# Altium schematic sheet Audio_Filters.SchDoc
size A
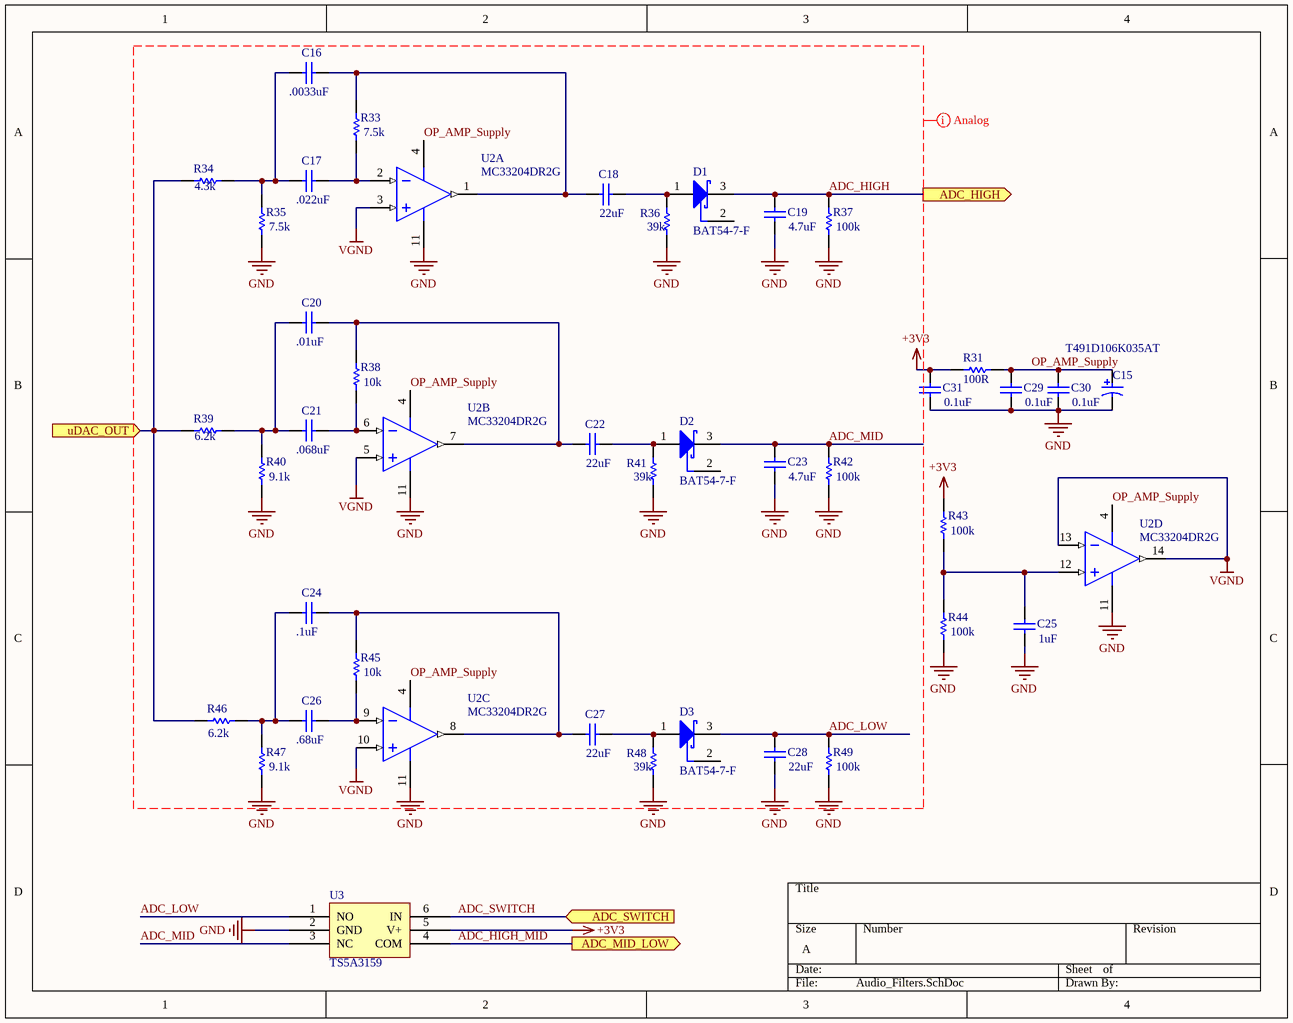
[diagram p0: Audio_Filters.SchDoc]

## Parts
C15  T491D106K035AT  [KEMT-T491-D_L]
C16  value .0033uF  [CAPC0805(2012)145_L]  (hidden comment: CAP0805)
C17  value .022uF  [CAPC0805(2012)145_L]  (hidden comment: CAP0805)
C18  value 22uF  [CAPC0805(2012)145_L]  (hidden comment: CAP0805)
C19  value 4.7uF  [CAPC0805(2012)145_L]  (hidden comment: CAP0805)
C20  value .01uF  [CAPC0805(2012)145_L]  (hidden comment: CAP0805)
C21  value .068uF  [CAPC0805(2012)145_L]  (hidden comment: CAP0805)
C22  value 22uF  [CAPC0805(2012)145_L]  (hidden comment: CAP0805)
C23  value 4.7uF  [CAPC0805(2012)145_L]  (hidden comment: CAP0805)
C24  value .1uF  [CAPC0805(2012)145_L]  (hidden comment: CAP0805)
C25  value 1uF  [CAPC0805(2012)145_L]  (hidden comment: CAP0805)
C26  value .68uF  [CAPC0805(2012)145_L]  (hidden comment: CAP0805)
C27  value 22uF  [CAPC0805(2012)145_L]  (hidden comment: CAP0805)
C28  value 22uF  [CAPC0805(2012)145_L]  (hidden comment: CAP0805)
C29  value 0.1uF  [CAPC0805(2012)145_L]  (hidden comment: CAP0805)
C30  value 0.1uF  [CAPC0805(2012)145_L]  (hidden comment: CAP0805)
C31  value 0.1uF  [CAPC0805(2012)145_L]  (hidden comment: CAP0805)
D1  BAT54-7-F  [DIOD-SOT23-3_V]
D2  BAT54-7-F  [DIOD-SOT23-3_V]
D3  BAT54-7-F  [DIOD-SOT23-3_V]
R31  value 100R  [RESC0805(2012)_L]  (hidden comment: RES0805)
R33  value 7.5k  [RESC0805(2012)_L]  (hidden comment: RES0805)
R34  value 4.3k  [RESC0805(2012)_L]  (hidden comment: RES0805)
R35  value 7.5k  [RESC0805(2012)_L]  (hidden comment: RES0805)
R36  value 39k  [RESC0805(2012)_L]  (hidden comment: RES0805)
R37  value 100k  [RESC0805(2012)_L]  (hidden comment: RES0805)
R38  value 10k  [RESC0805(2012)_L]  (hidden comment: RES0805)
R39  value 6.2k  [RESC0805(2012)_L]  (hidden comment: RES0805)
R40  value 9.1k  [RESC0805(2012)_L]  (hidden comment: RES0805)
R41  value 39k  [RESC0805(2012)_L]  (hidden comment: RES0805)
R42  value 100k  [RESC0805(2012)_L]  (hidden comment: RES0805)
R43  value 100k  [RESC0805(2012)_L]  (hidden comment: RES0805)
R44  value 100k  [RESC0805(2012)_L]  (hidden comment: RES0805)
R45  value 10k  [RESC0805(2012)_L]  (hidden comment: RES0805)
R46  value 6.2k  [RESC0805(2012)_L]  (hidden comment: RES0805)
R47  value 9.1k  [RESC0805(2012)_L]  (hidden comment: RES0805)
R48  value 39k  [RESC0805(2012)_L]  (hidden comment: RES0805)
R49  value 100k  [RESC0805(2012)_L]  (hidden comment: RES0805)
U2  MC33204DR2G  [ONSC-SOIC-14-751A-03_V]  (parts A,B,C,D of 4)
U3  TS5A3159  [SOT95P280X145-6N]

## Ports
ADC_HIGH (out), ADC_MID_LOW (out), ADC_SWITCH (in), uDAC_OUT (in)

## Nets
+3V3: C31.2 R31.2 R43.2 U3.5(V+)
GND: C15.2 C19.1 C23.1 C25.1 C28.1 C29.1 C30.1 C31.1 R35.2 R36.1 R37.1 R40.2 R41.1 R42.1 R44.1 R47.2 R48.1 R49.1 U2.11(VEE) U3.2(GND)
VGND: U2.3(IN1+) U2.5(IN2+) U2.10(IN3+) U2.13(IN4-) U2.14(OUT4)
ADC_HIGH: C19.2 D1.3(K) R37.2 ; port ADC_HIGH
ADC_HIGH_MID: U3.4(COM) ; port ADC_MID_LOW
ADC_LOW: C28.2 D3.3(K) R49.2 U3.1(NO)
ADC_MID: C23.2 D2.3(K) R42.2 U3.3(NC)
ADC_SWITCH: U3.6(IN) ; port ADC_SWITCH
OP_AMP_Supply: C15.1 C29.2 C30.2 R31.1 U2.4(VCC)
uDAC_OUT: R34.1 R39.1 R46.1 ; port uDAC_OUT
NetC16_1: C16.1 C17.1 R34.2 R35.1
NetC16_2: C16.2 C18.1 R33.1 U2.1(OUT1)
NetC17_2: C17.2 R33.2 U2.2(IN1-)
NetC18_2: C18.2 D1.1(A) R36.2
NetC20_1: C20.1 C21.1 R39.2 R40.1
NetC20_2: C20.2 C22.1 R38.1 U2.7(OUT2)
NetC21_2: C21.2 R38.2 U2.6(IN2-)
NetC22_2: C22.2 D2.1(A) R41.2
NetC24_1: C24.1 C26.1 R46.2 R47.1
NetC24_2: C24.2 C27.1 R45.1 U2.8(OUT3)
NetC25_2: C25.2 R43.1 R44.2 U2.12(IN4+)
NetC26_2: C26.2 R45.2 U2.9(IN3-)
NetC27_2: C27.2 D3.1(A) R48.2

Not connected (* = marked no-connect by the designer): D1 2; D2 2; D3 2

## Layout directives
net class Analog: +3V3, ADC_HIGH, ADC_LOW, ADC_MID, GND, OP_AMP_Supply, VGND

## Library data of the parts
C15 = CMP-2000-07580-1: Tantalum Capacitor, 10 uF, +/- 10%, 35 V, -55 to 125 degC, 2-Pin SMD, RoHS, Tape and Reel; Manufacturer: Kemet; Capacitance: 10uF; Leakage Current: 3.5uA; Dissipation Factor: 6%; Case\/Package: 2917; Polarity: Polar; Voltage Rating: 35V; ESR (Equivalent Series Resistance): 1Ohm; Life (Hours): 2000Hour; Tolerance: 20%; Max Operating Temperature: 125degC; Length: 7.3mm; Depth: 4.3mm; Termination: SMD/SMT; Case Code (Metric): 7343; Number of Pins: 2; Package Reference: T491-D; Width: 4.3mm; RoHSCompliant: True; Lead Free: LeadFree; Radiation Hardening: No; Height: 2.8mm; Voltage Rating (DC): 35V; REACH SVHC: NoSVHC; Datasheet URL: http://www.kemet.com/Lists/ProductCatalog/Attachments/254/KEM_T2005_T491.pdf; Datasheet Version: 07/2017; Manufacturer URL: http://www.kemet.com/; Mounting Technology: SurfaceMount; Min Operating Temperature: -55degC; Case Code (Imperial): 2917; Package Quantity: 1; Packaging: TapeandReel; Package Description: 2-Pin Surface Mount Device, Body 7.3 x 4.3 mm; Height - Seated (Max): 0.122inch; Voltage: 35V; Dielectric Material: Tantalum; Mount: PCB
C16-C31 = CMP-1590-00003-1: 0805 (2012 Metric) Chip Capacitor; Case-EIA: 0805; Case-Metric: 2012; PackageReference: CAPC0805(2012)145
D1-D3 = CMP-0303-00002-1: Schottky Diode, 30V ,200mW, SOT23-3; Manufacturer: Diodes Inc; Forward Current Limit: 200 mA; Reverse Current: 2 uA @25 V; PackageReference: SOT23; ComponentLink3URL: http://www.diodes.com/datasheets/ap02002.pdf; ComponentLink3Description: Package Specification; PartNumber: BAT54-7-F; Storage Temperature: -55 to 150 degC; ComponentLink1Description: Manufacturer URL; Mounting Technology: Surface Mount; ComponentLink2Description: Datasheet; Power Dissipation: 200 mW; PackageVersion: Rev. 73; ComponentLink1URL: http://www.diodes.com/; PackageDescription: 3-Pin SOT23, 3 x 1.4 mm Body, 0.95 mm Pitch; ComponentLink2URL: http://www.diodes.com/datasheets/ds11005.pdf
R31 R33-R49 = CMP-1591-00002-1: 0805 (2012 Metric) Chip Resistor; Case-EIA: 0805; Case-Metric: 2012; PackageReference: RESC0805(2012)
U2 = CMP-1310-00192-1: Low Voltage, Rail-to-Rail Operational Amplifier, 1.8 to 12 V, -40 to 105 degC, 14-Pin SOIC, Pb-Free, Tape and Reel; Manufacturer: On Semiconductor; SR Typ (V/uS): 1; GBW Typ (MHz): 2.2; VCC Min (V): 1.8; VCC Max (V): 12; ComponentLink2URL: http://www.onsemi.cn/pub_link/Collateral/MC33201-D.PDF; RoHS: TRUE; DatasheetVersion: Rev. 17; ComponentLink3URL: http://www.onsemi.com/pub_link/Collateral/751A-03.PDF; PackageReference: SOIC-14-751A-03; Packing: Tape and Reel; ComponentLink1Description: Manufacturer URL; ComponentLink3Description: Package Specification; Mounting Technology: Surface Mount; ComponentLink1URL: http://www.onsemi.com/; PartNumber: MC33204DR2G; PackageVersion: Rev. K, 05/2011; PackageDescription: 14-Pin Small Outline Integrated Circuit, Body 8.65 x 3.9 mm, Pitch 1.27 mm; ComponentLink2Description: Datasheet; PartId: 1
U3 = TS5A3159: A 2 to 1 mux for reducing number of ADCs required